# Altium schematic sheet TELESPOR_ADAPTER.SchDoc
size A3; DocumentNumber: 1; SheetNumber: 1; SheetTotal: 9
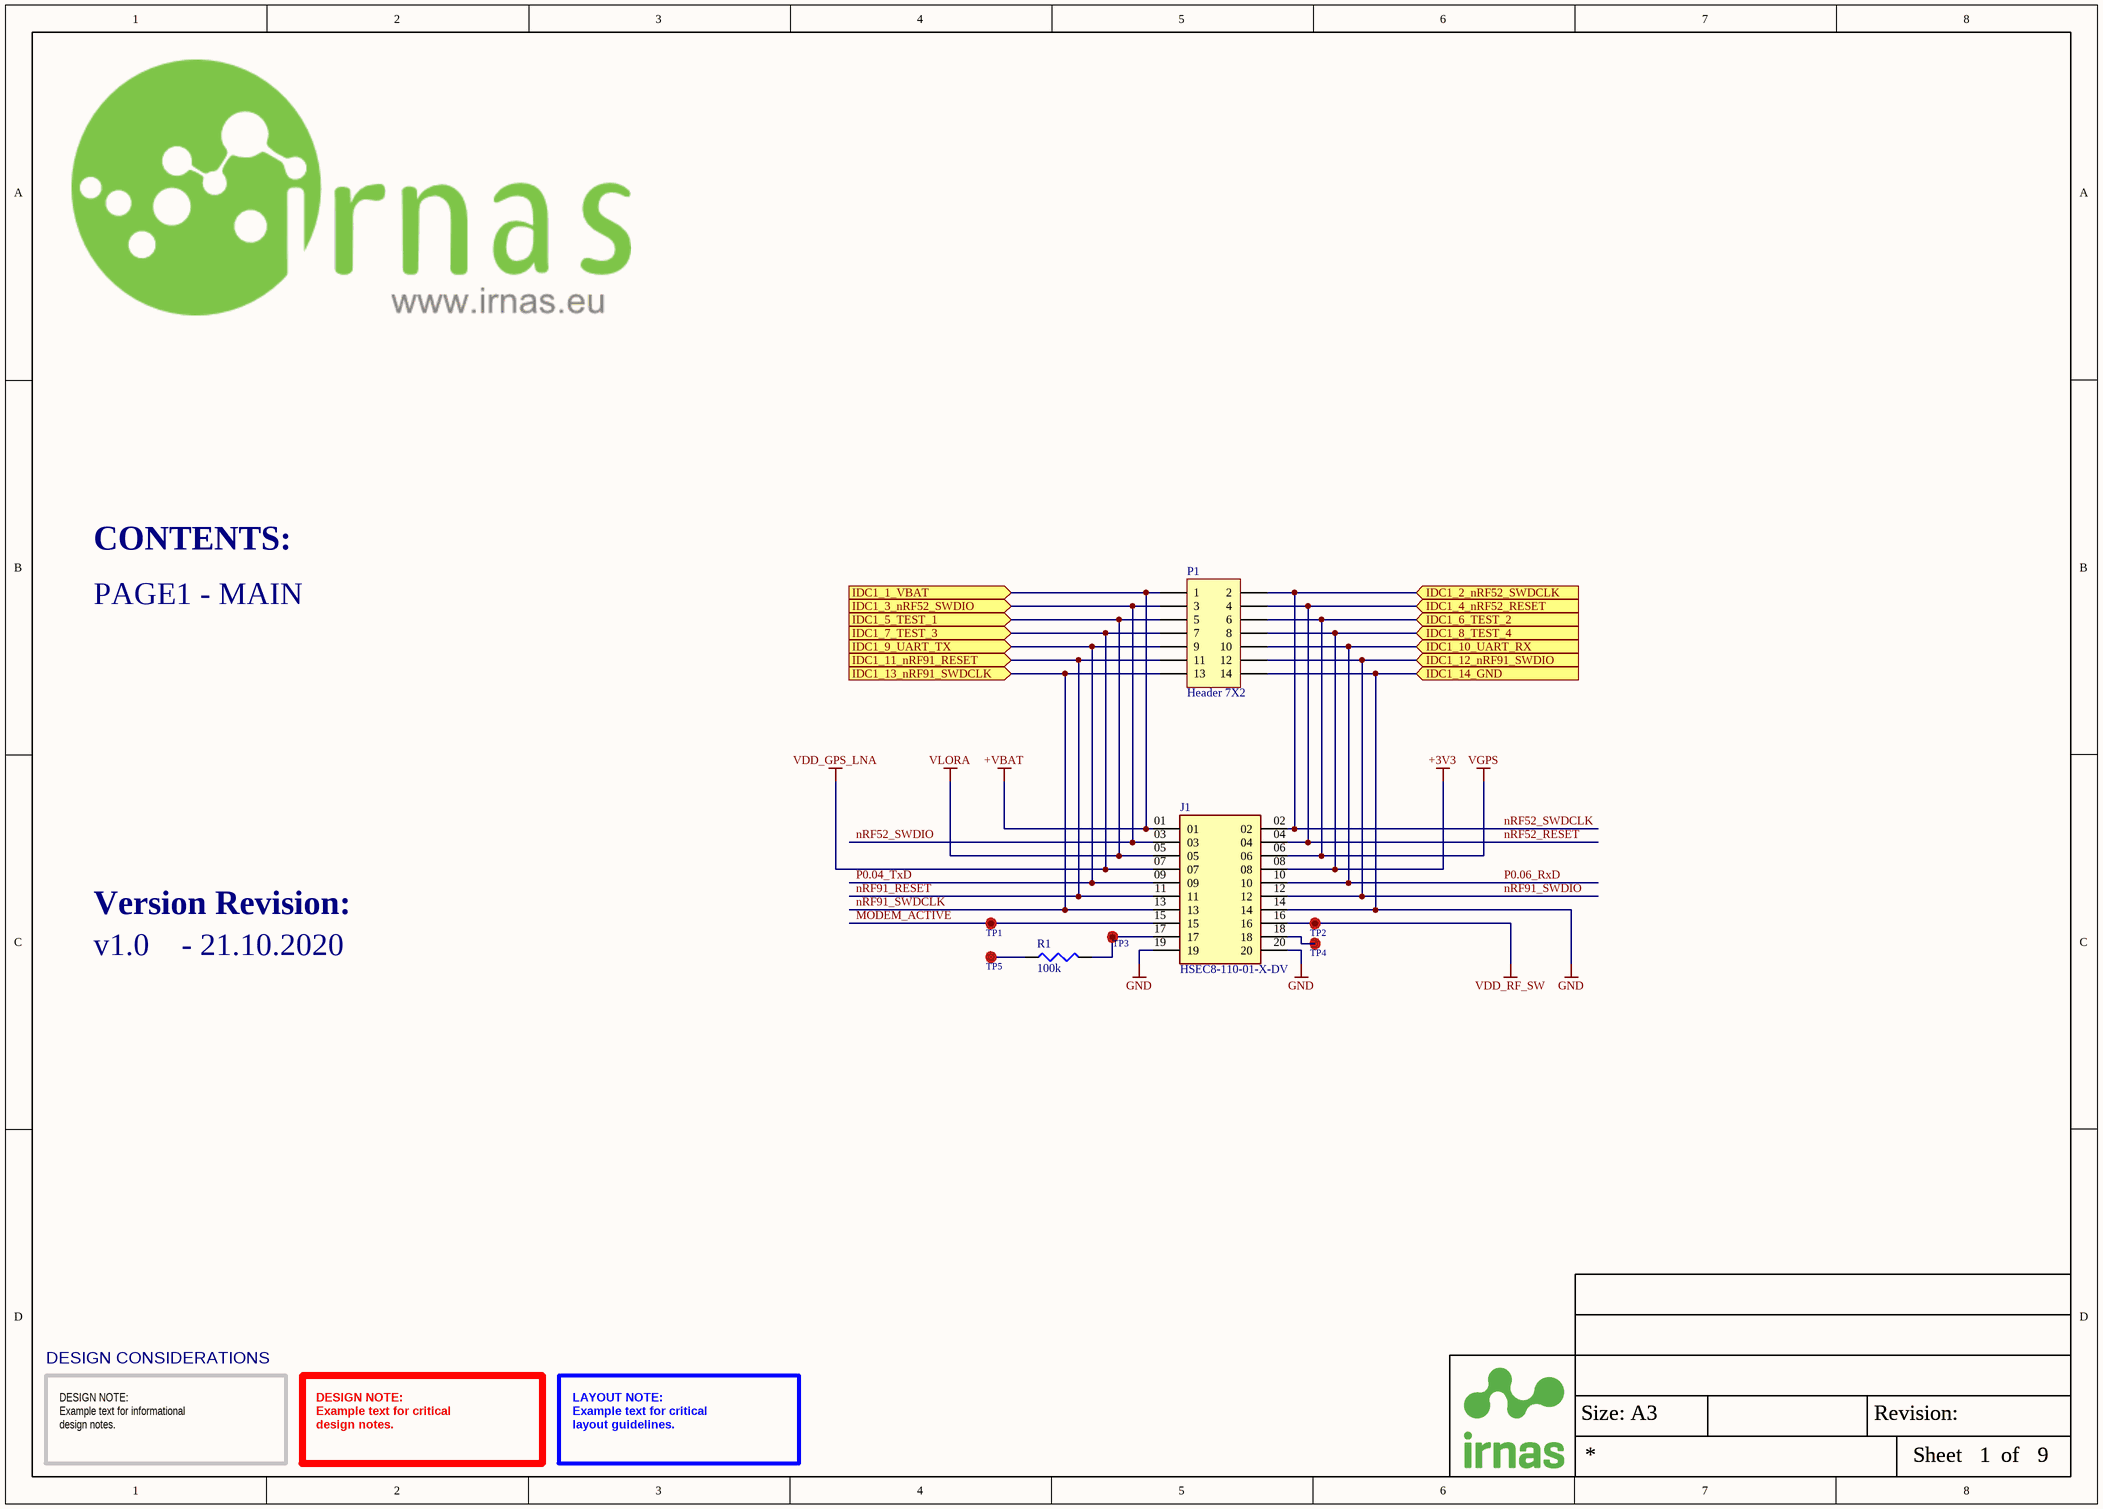
[diagram p0: TELESPOR_ADAPTER.SchDoc]

## Parts
J1  HSEC8-110-01-X-DV  [SAMTEC_HSEC8-110-01-X-DV]
P1  Header 7X2  [HDR2X7]
R1  100k  [RES0402]
TP1  TestPoint  [TestPoint:1.2x1.2mm]  (value not drawn)
TP2  TestPoint  [TestPoint:1.2x1.2mm]  (value not drawn)
TP3  TestPoint  [TestPoint:1.2x1.2mm]  (value not drawn)
TP4  TestPoint  [TestPoint:1.2x1.2mm]  (value not drawn)
TP5  TestPoint  [TestPoint:1.2x1.2mm]  (value not drawn)

## Ports
IDC1_1_VBAT (in), IDC1_2_nRF52_SWDCLK (in), IDC1_3_nRF52_SWDIO (in), IDC1_4_nRF52_RESET (in), IDC1_5_TEST_1 (in), IDC1_6_TEST_2 (in), IDC1_7_TEST_3 (in), IDC1_8_TEST_4 (in), IDC1_9_UART_TX (in), IDC1_10_UART_RX (in), IDC1_11_nRF91_RESET (in), IDC1_12_nRF91_SWDIO (in), IDC1_13_nRF91_SWDCLK (in), IDC1_14_GND (in)

## Nets
+3V3: J1.08 P1.8 ; port IDC1_8_TEST_4
+VBAT: J1.01 P1.1 ; port IDC1_1_VBAT
GND: J1.14 J1.19 J1.20 P1.14 ; port IDC1_14_GND
VDD_GPS_LNA: J1.07 P1.7 ; port IDC1_7_TEST_3
VDD_RF_SW: J1.16 TP2.0
VGPS: J1.06 P1.6 ; port IDC1_6_TEST_2
VLORA: J1.05 P1.5 ; port IDC1_5_TEST_1
MODEM_ACTIVE: J1.15 TP1.0
nRF52_RESET: J1.04 P1.4 ; port IDC1_4_nRF52_RESET
nRF52_SWDCLK: J1.02 P1.2 ; port IDC1_2_nRF52_SWDCLK
nRF52_SWDIO: J1.03 P1.3 ; port IDC1_3_nRF52_SWDIO
nRF91_RESET: J1.11 P1.11 ; port IDC1_11_nRF91_RESET
nRF91_SWDCLK: J1.13 P1.13 ; port IDC1_13_nRF91_SWDCLK
nRF91_SWDIO: J1.12 P1.12 ; port IDC1_12_nRF91_SWDIO
P0.04_TxD: J1.09 P1.9 ; port IDC1_9_UART_TX
P0.06_RxD: J1.10 P1.10 ; port IDC1_10_UART_RX
NetJ1_17: J1.17 R1.2 TP3.0
NetJ1_18: J1.18 TP4.0
NetR1_1: R1.1 TP5.0

## Notes on the sheet
- CONTENTS:
- PAGE1 - MAIN
- Version Revision:
- v1.0    - 21.10.2020
- DESIGN CONSIDERATIONS
- DESIGN NOTE:
  Example text for informational
  design notes.
- DESIGN NOTE:
  Example text for critical
  design notes.
- LAYOUT NOTE:
  Example text for critical
  layout guidelines.
- Size: A3
- Revision:
- Sheet
- of

## Library data of the parts
J1 = HSEC8-110-01-X-DV: 20 Position Female Connector Non Specified - Dual Edge Gold 0.031 (0.80mm) Black; MF: Samtec; MP: HSEC8-110-01-L-DV; Price: None; Availability: Bad; SnapEDA_Link: https://www.snapeda.com/parts/HSEC8-110-01-L-DV/Samtec/view-part/3406415/?ref=snap; Value: *; Check_prices: https://www.snapeda.com/parts/HSEC8-110-01-L-DV/Samtec/view-part/3406415/?ref=eda; Purchase-URL: https://pricing.snapeda.com/search/part/HSEC8-110-01-L-DV/?ref=eda; Package: None
P1 = Header 7X2: Header, 7-Pin, Dual row; LatestRevisionDate: 17-Jul-2002; LatestRevisionNote: Re-released for DXP Platform.; Publisher: Altium Limited
R1 = R - 100k/0402: MULTICOMP   MCWR04X1003FTL   RES, THICK FILM, 100KOHM, 1%, 0.0625W; IRNAS Part No.: I-100013; Resistance: 100kR; Power Rating: 62.5mW; Voltage Rating: 50V; Temperature Coefficient: 100ppm/°C; Supplier 1: Farnell; Manufacturer: Multicomp; Manufacturer Part Number: MCWR04X1003FTL; Stock 1: 161188; Pricing 1: 10=0.0029, 100=0.0017, 500=0.0012, 2500=0.001, 5000=0.0008 (EUR); Mount: Surface Mount; Case/Package: 0402; Case Code (Metric): 1005; Case Code (Imperial): 0402; Tolerance: 1%; Packaging: Cut Tape; Composition: Thick Film; Voltage Rating (DC): 50V; REACH SVHC: No SVHC; ComponentLink1URL: https://datasheet.ciiva.com/46386/1849611-46386524.pdf; ComponentLink1Description: https://datasheet.ciiva.com/46386/1849611-46386524.pdf; Supplier Part Number 1: 2447094
TP1-TP5 = TestPoint: TEST POINT ROUND SMD; FIT: 0.94; Komp / Device: SMD; ComponentLink1Description: Datasheet